# EAGLE design IFM_DuberFilter_ThroughHole_PCB_REV1a (EAGLE 9.6.2)
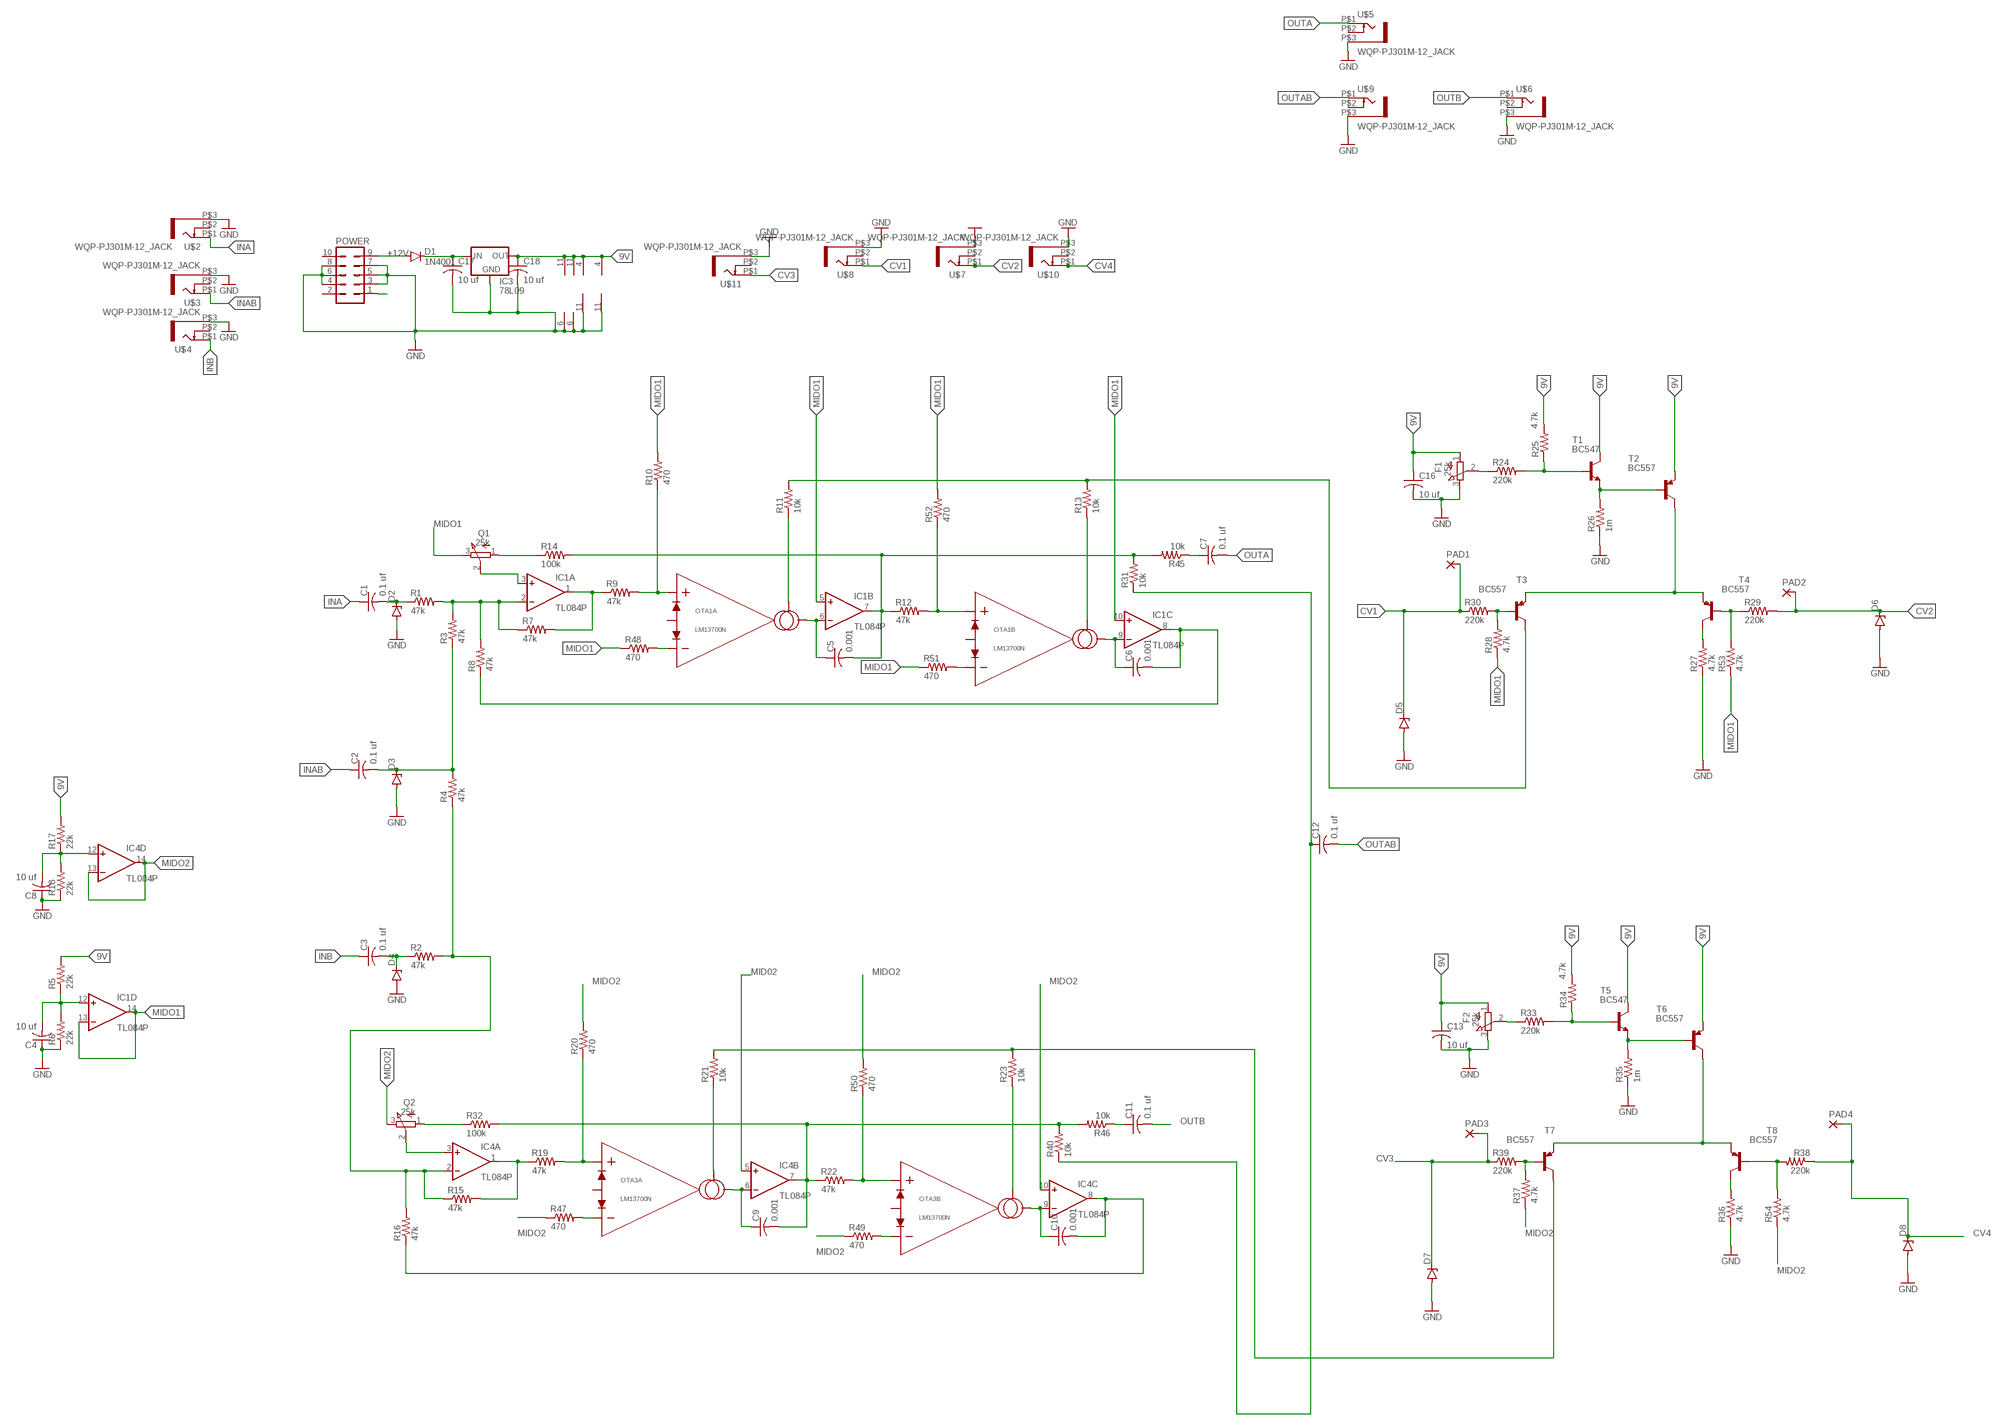
[diagram p0: schematic, sheet 1]

## Parts
C1  0.1 uf  C-US050-030X075  [C050-030X075]
C2  0.1 uf  C-US050-030X075  [C050-030X075]
C3  0.1 uf  C-US050-030X075  [C050-030X075]
C4  10 uf  C-US050-030X075  [C050-030X075]
C5  0.001  C-US050-030X075  [C050-030X075]
C6  0.001  C-US050-030X075  [C050-030X075]
C7  0.1 uf  C-US050-030X075  [C050-030X075]
C8  10 uf  C-US050-030X075  [C050-030X075]
C9  0.001  C-US050-030X075  [C050-030X075]
C10  0.001  C-US050-030X075  [C050-030X075]
C11  0.1 uf  C-US050-030X075  [C050-030X075]
C12  0.1 uf  C-US050-030X075  [C050-030X075]
C13  10 uf  C-US050-030X075  [C050-030X075]
C16  10 uf  C-US050-030X075  [C050-030X075]
C17  10 uf  C-US050-030X075  [C050-030X075]
C18  10 uf  C-US050-030X075  [C050-030X075]
D1  1N4001  1N4004  [DO41-10]
D2  ZENER-DIODEDO34-7  [DO34Z7]
D3  ZENER-DIODEDO34-7  [DO34Z7]
D4  ZENER-DIODEDO34-7  [DO34Z7]
D5  ZENER-DIODEDO34-7  [DO34Z7]
D6  ZENER-DIODEDO34-7  [DO34Z7]
D7  ZENER-DIODEDO34-7  [DO34Z7]
D8  ZENER-DIODEDO34-7  [DO34Z7]
F1  25k  EVUF3L  [EVUFXL]
F2  25k  EVUF3L  [EVUFXL]
IC1  TL084P  [DIL14]
IC3  78L09  78LXX  [78LXX]
IC4  TL084P  [DIL14]
OTA1  LM13700N  [DIP16]
OTA3  LM13700N  [DIP16]
PAD1  SMD2  [SMD1,27-2,54]
PAD2  SMD2  [SMD1,27-2,54]
PAD3  SMD2  [SMD1,27-2,54]
PAD4  SMD2  [SMD1,27-2,54]
POWER  10_PIN_HEADER  [MA05-2]
Q1  25k  EVUF3L  [EVUFXL]
Q2  25k  EVUF3L  [EVUFXL]
R1  47k  R-US_0204/7  [0204/7]
R2  47k  R-US_0204/7  [0204/7]
R3  47k  R-US_0204/7  [0204/7]
R4  47k  R-US_0204/7  [0204/7]
R5  22k  R-US_0204/7  [0204/7]
R6  22k  R-US_0204/7  [0204/7]
R7  47k  R-US_0204/7  [0204/7]
R8  47k  R-US_0204/7  [0204/7]
R9  47k  R-US_0204/7  [0204/7]
R10  470  R-US_0204/7  [0204/7]
R11  10k  R-US_0204/7  [0204/7]
R12  47k  R-US_0204/7  [0204/7]
R13  10k  R-US_0204/7  [0204/7]
R14  100k  R-US_0204/7  [0204/7]
R15  47k  R-US_0204/7  [0204/7]
R16  47k  R-US_0204/7  [0204/7]
R17  22k  R-US_0204/7  [0204/7]
R18  22k  R-US_0204/7  [0204/7]
R19  47k  R-US_0204/7  [0204/7]
R20  470  R-US_0204/7  [0204/7]
R21  10k  R-US_0204/7  [0204/7]
R22  47k  R-US_0204/7  [0204/7]
R23  10k  R-US_0204/7  [0204/7]
R24  220k  R-US_0204/7  [0204/7]
R25  4.7k  R-US_0204/7  [0204/7]
R26  1m  R-US_0204/7  [0204/7]
R27  4.7k  R-US_0204/7  [0204/7]
R28  4.7k  R-US_0204/7  [0204/7]
R29  220k  R-US_0204/7  [0204/7]
R30  220k  R-US_0204/7  [0204/7]
R31  10k  R-US_0204/7  [0204/7]
R32  100k  R-US_0204/7  [0204/7]
R33  220k  R-US_0204/7  [0204/7]
R34  4.7k  R-US_0204/7  [0204/7]
R35  1m  R-US_0204/7  [0204/7]
R36  4.7k  R-US_0204/7  [0204/7]
R37  4.7k  R-US_0204/7  [0204/7]
R38  220k  R-US_0204/7  [0204/7]
R39  220k  R-US_0204/7  [0204/7]
R40  10k  R-US_0204/7  [0204/7]
R45  10k  R-US_0204/7  [0204/7]
R46  10k  R-US_0204/7  [0204/7]
R47  470  R-US_0204/7  [0204/7]
R48  470  R-US_0204/7  [0204/7]
R49  470  R-US_0204/7  [0204/7]
R50  470  R-US_0204/7  [0204/7]
R51  470  R-US_0204/7  [0204/7]
R52  470  R-US_0204/7  [0204/7]
R53  4.7k  R-US_0204/7  [0204/7]
R54  4.7k  R-US_0204/7  [0204/7]
T1  BC547  [TO92]
T2  BC557  BC557A-PNP-TO92-EBC  [TO92-EBC]
T3  BC557  BC557A-PNP-TO92-EBC  [TO92-EBC]
T4  BC557  BC557A-PNP-TO92-EBC  [TO92-EBC]
T5  BC547  [TO92]
T6  BC557  BC557A-PNP-TO92-EBC  [TO92-EBC]
T7  BC557  BC557A-PNP-TO92-EBC  [TO92-EBC]
T8  BC557  BC557A-PNP-TO92-EBC  [TO92-EBC]
U$2  WQP-PJ301M-12_JACK  [WQP-PJ301M-12_JACK]
U$3  WQP-PJ301M-12_JACK  [WQP-PJ301M-12_JACK]
U$4  WQP-PJ301M-12_JACK  [WQP-PJ301M-12_JACK]
U$5  WQP-PJ301M-12_JACK  [WQP-PJ301M-12_JACK]
U$6  WQP-PJ301M-12_JACK  [WQP-PJ301M-12_JACK]
U$7  WQP-PJ301M-12_JACK  [WQP-PJ301M-12_JACK]
U$8  WQP-PJ301M-12_JACK  [WQP-PJ301M-12_JACK]
U$9  WQP-PJ301M-12_JACK  [WQP-PJ301M-12_JACK]
U$10  WQP-PJ301M-12_JACK  [WQP-PJ301M-12_JACK]
U$11  WQP-PJ301M-12_JACK  [WQP-PJ301M-12_JACK]

## Nets
9V: C13.1 C16.1 C18.1 F1.1(A) F2.1(A) IC1.4(P:V+) IC3.OUT IC4.4(P:V+) OTA1.11(PWR:VCC) OTA3.11(PWR:VCC) R5.2 R17.2 R25.2 R34.2 T1.3(C) T2.E T5.3(C) T6.E
+12V [power]: C17.1 D1.C IC3.IN
-12V [power]: POWER.1
CV1: D5.C PAD1.1(P) R30.1 U$8.P$1
CV2: D6.C PAD2.1(P) R29.2 U$7.P$1
CV3: D7.C PAD3.1(P) R39.1 U$11.P$1
CV4: D8.C PAD4.1(P) R38.1 U$10.P$1
GND: C4.1 C8.1 C13.2 C16.2 C17.2 C18.2 D2.A D3.A D4.A D5.A D6.A D7.A D8.A F1.3(E) F2.3(E) IC1.11(P:V-) IC3.GND IC4.11(P:V-) OTA1.6(PWR:VEE) OTA3.6(PWR:VEE) POWER.3 POWER.4 POWER.5 POWER.6 POWER.7 POWER.8 R6.1 R18.1 R26.1 R27.1 R35.1 R36.1 U$2.P$3 U$3.P$3 U$4.P$3 U$5.P$3 U$6.P$3 U$7.P$3 U$8.P$3 U$9.P$3 U$10.P$3 U$11.P$3
INA: C1.1 U$2.P$1
INAB: C2.1 U$3.P$1
INB: C3.1 U$4.P$1
MID02: IC4.5(B:+IN)
MIDO1: IC1.5(B:+IN) IC1.10(C:+IN) IC1.13(D:-IN) IC1.14(D:OUT) Q1.3(E) R10.2 R28.1 R48.1 R51.1 R52.2 R53.1
MIDO2: IC4.10(C:+IN) IC4.13(D:-IN) IC4.14(D:OUT) Q2.3(E) R20.2 R37.1 R47.1 R49.1 R50.2 R54.1
N$1: C3.2 D4.C R2.1
N$2: C1.2 D2.C R1.1
N$3: C2.2 D3.C R3.1 R4.2
N$4: IC4.2(A:-IN) R2.2 R4.1 R15.1 R16.2
N$5: IC1.2(A:-IN) R1.2 R3.2 R7.1 R8.2
N$6: OTA1.16(B:IABC) R13.1
N$7: C4.2 IC1.12(D:+IN) R5.1 R6.2
N$8: Q1.1(A) R14.1
N$9: OTA1.13(B:IN-) R51.2
N$10: IC4.1(A:OUT) R15.2 R19.1
N$11: IC1.1(A:OUT) R7.2 R9.1
N$12: OTA1.3(A:IN+) R9.2 R10.1
N$13: C5.1 IC1.6(B:-IN) OTA1.5(A:IOUT)
N$14: OTA1.1(A:IABC) R11.1
N$15: C5.2 IC1.7(B:OUT) R12.1 R14.2 R31.2 R45.2
N$16: R29.1 R53.2 T4.B
N$17: R11.2 R13.2 T3.C
N$18: C6.1 IC1.9(C:-IN) OTA1.12(B:IOUT)
N$19: C6.2 IC1.8(C:OUT) R8.1
N$20: IC1.3(A:+IN) Q1.2(S)
N$21: F1.2(S) R24.1
N$22: OTA1.14(B:IN+) R12.2 R52.1
N$23: OTA3.3(A:IN+) R19.2 R20.1
N$24: C8.2 IC4.12(D:+IN) R17.1 R18.2
N$25: C9.1 IC4.6(B:-IN) OTA3.5(A:IOUT)
N$26: OTA3.1(A:IABC) R21.1
N$27: C9.2 IC4.7(B:OUT) R22.1 R32.2 R40.2 R46.2
N$28: OTA3.16(B:IABC) R23.1
N$29: R21.2 R23.2 T7.C
N$30: Q2.1(A) R32.1
N$31: C10.1 IC4.9(C:-IN) OTA3.12(B:IOUT)
N$32: C10.2 IC4.8(C:OUT) R16.1
N$33: D1.A POWER.9
N$34: IC4.3(A:+IN) Q2.2(S)
N$35: OTA1.4(A:IN-) R48.2
N$36: R33.2 R34.1 T5.2(B)
N$38: R24.2 R25.1 T1.2(B)
N$40: R26.2 T1.1(E) T2.B
N$41: T2.C T3.E T4.E
N$42: R35.2 T5.1(E) T6.B
N$43: R27.2 T4.C
N$44: C12.1 R31.1 R40.1
N$45: R28.2 R30.2 T3.B
N$46: F2.2(S) R33.1
N$47: C11.1 R46.1
N$50: T6.C T7.E T8.E
N$51: R36.2 T8.C
N$52: R38.2 R54.2 T8.B
N$53: R37.2 R39.2 T7.B
N$55: OTA3.4(A:IN-) R47.2
N$56: OTA3.13(B:IN-) R49.2
N$57: OTA3.14(B:IN+) R22.2 R50.1
N$66: C7.1 R45.1
OUTA: C7.2 U$5.P$1
OUTAB: C12.2 U$9.P$1
OUTB: C11.2 U$6.P$1
Unconnected: OTA1.2(A:BIAS) OTA1.7(BUFA:IN) OTA1.8(BUFA:OUT) OTA1.9(BUFB:OUT) OTA1.10(BUFB:IN) OTA1.15(B:BIAS) OTA3.2(A:BIAS) OTA3.7(BUFA:IN) OTA3.8(BUFA:OUT) OTA3.9(BUFB:OUT) OTA3.10(BUFB:IN) OTA3.15(B:BIAS) POWER.2 POWER.10 U$2.P$2 U$3.P$2 U$4.P$2 U$5.P$2 U$6.P$2 U$7.P$2 U$8.P$2 U$9.P$2 U$10.P$2 U$11.P$2

## Library data of the parts
C1-C13 C16-C18 = rcl:C-US: CAPACITOR, American symbol; SPICEPREFIX: C
D1 = diode:1N4004: DIODE general purpose rectifier, 1 A
D2 D4-D8 = diode:ZENER-DIODE: Z-Diode
D3 = diode:ZENER-DIODE: Z-Diode; SPICEPREFIX: D
F1 F2 Q1 Q2 = pot:EVU: 9 mm Square Rotary Potentiometers Source: Panasonic
IC1 IC4 = linear:TL084: OP AMP
IC3 = v-reg:78LXX: VOLTAGE REGULATOR
OTA1 OTA3 = OTAs:LM13700: Dual OTA with linearizing diode and output buffers - 2MHz open-loop bandwidth - Linearizing diodes reduces distortion at higher differential input voltages - Darlington output buffers enables low-impedance output LM13700 or LM13600 The LM13700 differs from the LM13600 in that the 13700's output buffers are biased independently from the transconductance amplifier, allowing superior performance in audio applications. Originally released by National Semiconductor Manufactured by Texas Instruments.
PAD1-PAD4 = wirepad:SMD2: SMD PAD
POWER = TomW:10_PIN_HEADER: PIN HEADER; OC_FARNELL: unknown; OC_NEWARK: unknown
R1-R40 R45-R54 = rcl:R-US_: RESISTOR, American symbol; SPICEPREFIX: R
T1 T5 = transistor:BC547: NPN TRANSISTOR
T2-T4 T6-T8 = transistor:*-PNP-: PNP Transistror
U$2-U$11 = thonkiconn:WQP-PJ301M-12_JACK

## Net classes
1 power: width 0.61 mm

## Board
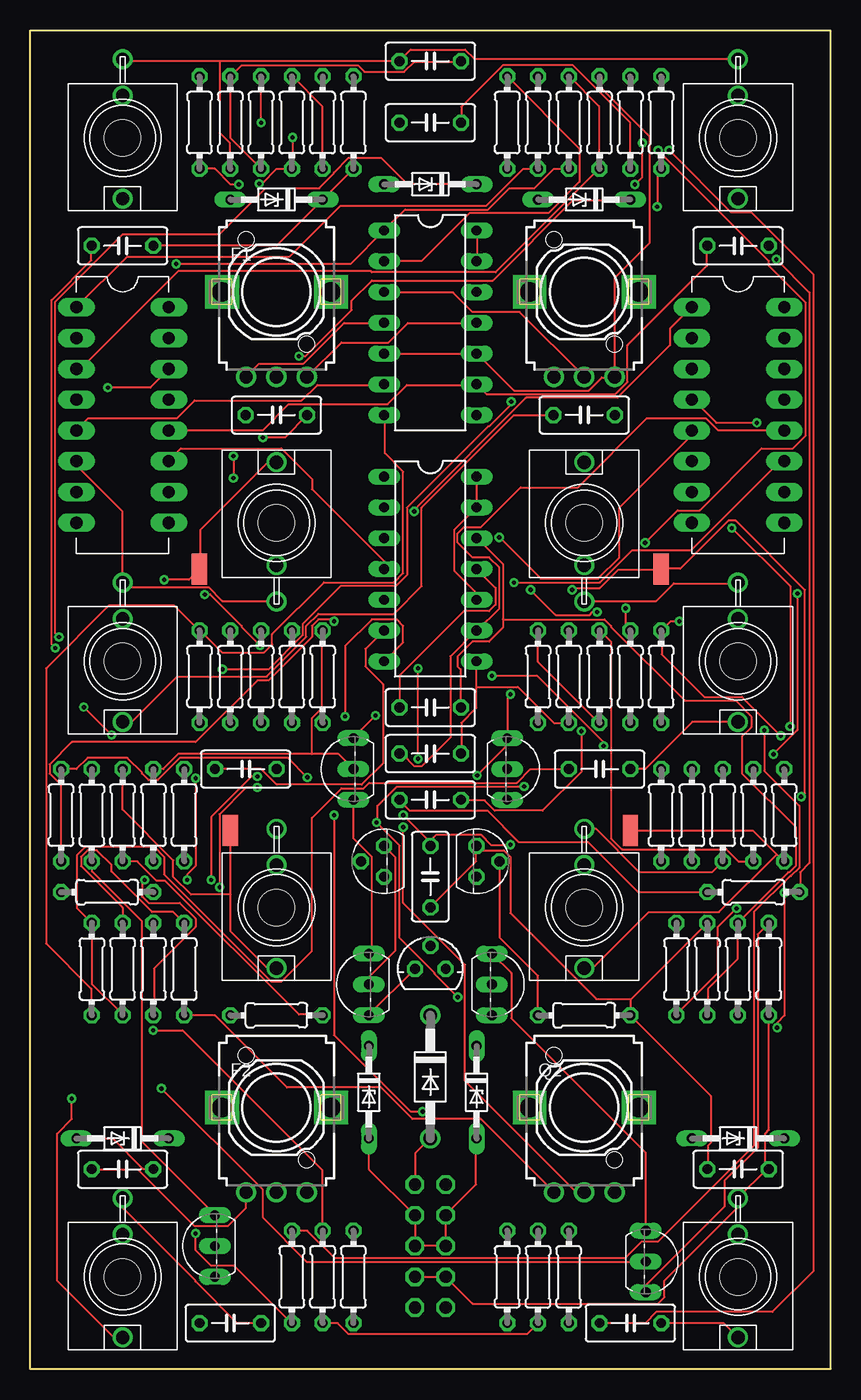
[diagram p1: board, top side]
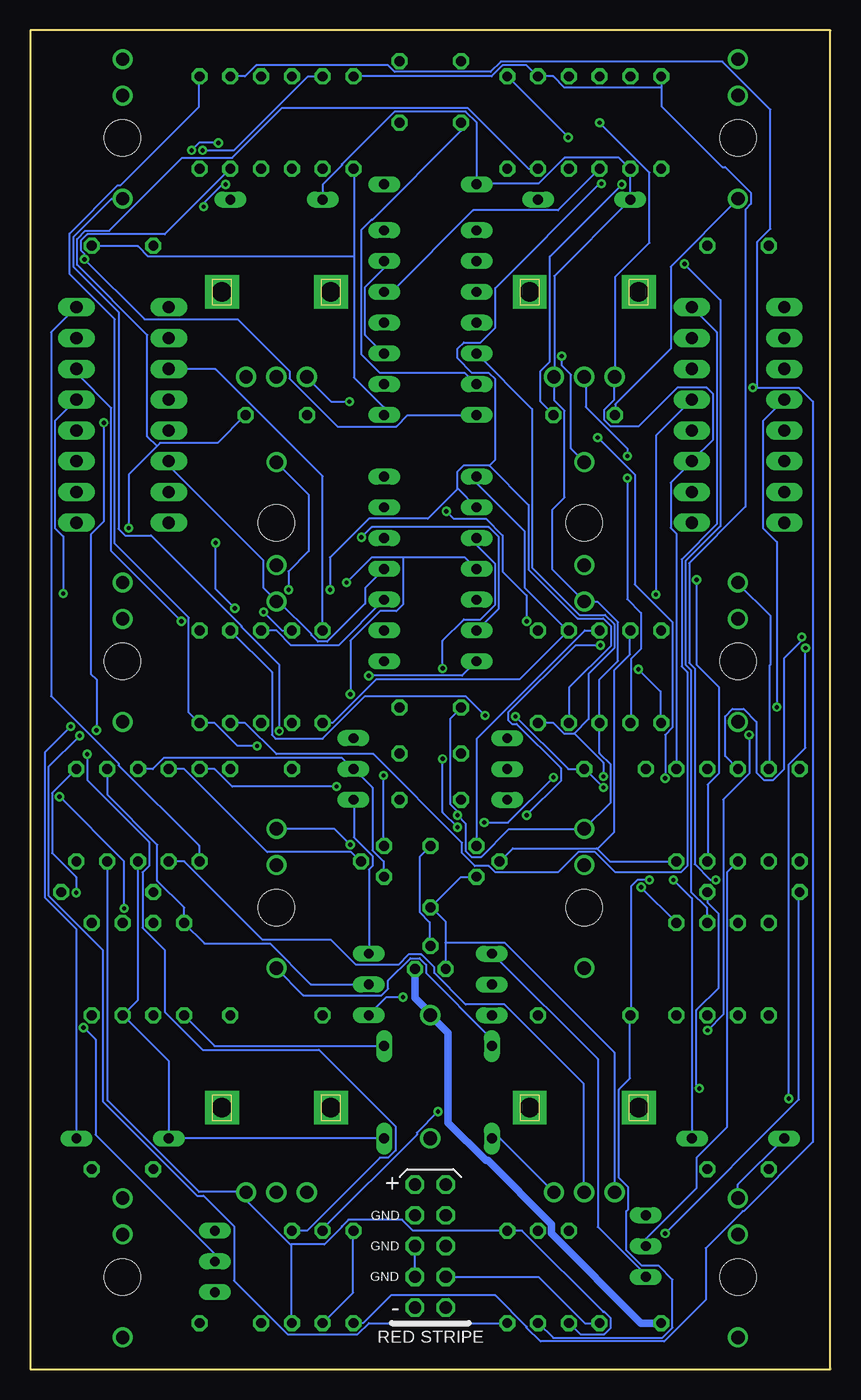
[diagram p2: board, bottom side, seen from below]

Size 66.04 x 110.49 mm. Coordinates in mm from the lower left corner, seen from the top.
Outline: 0,110.49 66.04,110.49 66.04,0 0,0 0,110.49
Copper layers (1*16): Top 0.035mm / dielectric 1.5mm / Bottom 0.035mm
Design rules "default": minimum track width 6mil, minimum drill 0.35mm, track to track 6mil, track to pad 6mil, pad to pad 6mil, via to via 6mil, smd to smd 6mil, copper to edge 40mil, drill to drill 6mil, minimum pad ring 10mil, minimum via ring 8mil, stop-mask expansion 4mil, vias tented up to drill 0mil, thermal gap 10mil
Holes 3 mm at 7.62,101.6 20.32,69.85 7.62,7.62 7.62,58.42 20.32,38.1 45.72,69.85 45.72,38.1 58.42,7.62 58.42,58.42 58.42,101.6

### Footprints (pad centres in the part's own frame; a part is rotated, then mirrored left to right if it is on the bottom)
C050-030X075 = drill 0.813 octagon: 1 -2.54,0; 2 2.54,0
DO41-10 = drill 1.118: A 5.08,0; C -5.08,0
DO34Z7 = drill 0.813 long: A 3.81,0; C -3.81,0
EVUFXL = drill 1.1 pad 1.676: 1 -2.5,-7; 2 0,-7; 3 2.5,-7 | drill 1.6 pad 2.8 square: M1 4.5,0; M2 -4.5,0
DIL14 = drill 0.813 long: 1 -7.62,-3.81; 2 -5.08,-3.81; 3 -2.54,-3.81; 4 0,-3.81; 5 2.54,-3.81; 6 5.08,-3.81; 7 7.62,-3.81; 8 7.62,3.81; 9 5.08,3.81; 10 2.54,3.81; 11 0,3.81; 12 -2.54,3.81; 13 -5.08,3.81; 14 -7.62,3.81
78LXX = drill 0.813 octagon: GND 0,1.905; IN 1.27,0; OUT -1.27,0
DIP16 = drill 1 long: 1 -3.81,0; 2 -3.81,-2.54; 3 -3.81,-5.08; 4 -3.81,-7.62; 5 -3.81,-10.16; 6 -3.81,-12.7; 7 -3.81,-15.24; 8 -3.81,-17.78; 9 3.81,-17.78; 10 3.81,-15.24; 11 3.81,-12.7; 12 3.81,-10.16; 13 3.81,-7.62; 14 3.81,-5.08; 15 3.81,-2.54; 16 3.81,0
SMD1,27-2,54 = smd 1.27 x 2.54: 1 0,0
MA05-2 = drill 1.016 octagon: 1 -5.08,-1.27; 2 -5.08,1.27; 3 -2.54,-1.27; 4 -2.54,1.27; 5 0,-1.27; 6 0,1.27; 7 2.54,-1.27; 8 2.54,1.27; 9 5.08,-1.27; 10 5.08,1.27
0204/7 = drill 0.813 octagon: 1 -3.81,0; 2 3.81,0
TO92 = drill 0.813 octagon: 1 1.27,0; 2 0,1.905; 3 -1.27,0
TO92-EBC = drill 0.813 long: B 0,-1.27; C 2.54,-1.27; E -2.54,-1.27
WQP-PJ301M-12_JACK = drill 1.1: P$1 0,5; P$2 0,-3.5; P$3 0,-6.5

### Placement (x,y rotation side)
C1  20.32,78.74 0 top
C2  45.72,78.74 0 top
C3  7.62,92.71 0 top
C4  33.02,107.95 0 top
C5  33.02,102.87 0 top
C6  58.42,92.71 0 top
C7  33.02,46.99 0 top
C8  33.02,54.61 0 top
C9  17.78,49.53 0 top
C10  33.02,50.8 0 top
C11  49.53,3.81 0 top
C12  46.99,49.53 0 top
C13  58.42,16.51 0 top
C16  7.62,16.51 0 top
C17  16.51,3.81 0 top
C18  33.02,40.64 90 top
D1  33.02,24.13 270 top
D2  7.62,19.05 180 top
D3  58.42,19.05 180 top
D4  20.32,96.52 180 top
D5  45.72,96.52 180 top
D6  33.02,97.79 180 top
D7  36.83,22.86 270 top
D8  27.94,22.86 270 top
F1  20.32,88.9 0 top
F2  20.32,21.59 0 top
IC1  33.02,86.36 270 top
IC3  33.02,33.02 0 top
IC4  33.02,66.04 270 top
OTA1  7.62,87.63 0 top
OTA3  58.42,87.63 0 top
PAD1  13.97,66.04 0 top
PAD2  16.51,44.45 0 top
PAD3  52.07,66.04 0 top
PAD4  49.53,44.45 0 top
POWER  33.02,10.16 90 bottom
Q1  45.72,88.9 0 top
Q2  45.72,21.59 0 top
R1  13.97,102.87 90 top
R2  26.67,102.87 90 top
R3  24.13,102.87 90 top
R4  21.59,102.87 90 top
R5  19.05,102.87 90 top
R6  16.51,102.87 90 top
R7  10.16,33.02 90 top
R8  39.37,102.87 90 top
R9  44.45,102.87 90 top
R10  46.99,102.87 90 top
R11  41.91,102.87 90 top
R12  49.53,102.87 90 top
R13  49.53,57.15 90 top
R14  13.97,57.15 90 top
R15  21.59,57.15 90 top
R16  44.45,57.15 90 top
R17  55.88,33.02 90 top
R18  58.42,33.02 90 top
R19  41.91,57.15 90 top
R20  46.99,57.15 90 top
R21  2.54,45.72 90 top
R22  52.07,57.15 90 top
R23  52.07,45.72 90 top
R24  16.51,57.15 90 top
R25  12.7,45.72 90 top
R26  19.05,57.15 90 top
R27  5.08,45.72 270 top
R28  24.13,57.15 90 top
R29  7.62,45.72 90 top
R30  10.16,45.72 90 top
R31  5.08,33.02 270 top
R32  12.7,33.02 90 top
R33  54.61,45.72 90 top
R34  45.72,29.21 0 top
R35  57.15,45.72 90 top
R36  60.96,33.02 90 top
R37  59.69,45.72 90 top
R38  62.23,45.72 90 top
R39  53.34,33.02 90 top
R40  7.62,33.02 90 top
R45  59.69,39.37 0 top
R46  52.07,102.87 90 top
R47  21.59,7.62 90 top
R48  24.13,7.62 90 top
R49  44.45,7.62 90 top
R50  26.67,7.62 90 top
R51  41.91,7.62 90 top
R52  39.37,7.62 90 top
R53  20.32,29.21 0 top
R54  6.35,39.37 0 top
T1  29.21,41.91 90 top
T2  26.67,31.75 90 top
T3  25.4,49.53 90 top
T4  13.97,10.16 90 top
T5  36.83,41.91 270 top
T6  40.64,49.53 270 top
T7  39.37,31.75 270 top
T8  52.07,8.89 270 top
U$2  7.62,101.6 180 top
U$3  7.62,58.42 180 top
U$4  7.62,7.62 180 top
U$5  58.42,101.6 180 top
U$6  58.42,7.62 180 top
U$7  20.32,38.1 180 top
U$8  20.32,69.85 0 top
U$9  58.42,58.42 180 top
U$10  45.72,38.1 180 top
U$11  45.72,69.85 0 top

### Tracks (layer width: path | path; a pad name or v marks a point on that pad's centre or on a via)
9V  (via drill 0.35)
  Top 0.152: R17.2 49.57,30.52 | 49.57,30.52 49.53,30.48 R34.2 49.53,29.18 56.16,22.55 56.16,18.67 55.93,18.44 55.93,16.54 C13.1 | C16.1 5.11,16.46 8.91,16.46 13.56,11.81 16.31,11.81 17.75,13.26 17.75,14.55 F2.1 | T2.E 27.96,29.26 31.7,32.99 IC3.OUT | 36.8,42.82 36.8,41.91 32.99,38.1 C18.1 | 36.8,42.82 36.8,43.13 T5.3 36.8,42.82 | v36.88,49 39.32,51.44 39.32,52.05 T6.E 39.4,52.12 39.4,55.47 v39.62,55.7 | 36.8,42.82 39.09,42.82 39.62,42.29 39.62,37.64 46.71,30.56 49.53,30.56 49.57,30.52 | IC1.4 29.18,86.33 25.91,86.33 22.55,82.98 18.9,82.98 17.83,81.92 F1.1 | v19.05,102.87 R5.2 | IC4.4 29.18,66.06 29.18,66.67 23.24,72.62 23.24,73.46 20.73,75.97 12.42,75.97 11.43,74.98 OTA1.11 | v39.93,64.92 47.02,64.92 49.68,67.59 54.56,67.59 61.87,74.91 62.18,74.91 OTA3.11
  Bottom 0.152: T1.3 29.26,40.62 30.48,40.62 32.99,38.1 C18.1 32.92,38.1 31.77,36.96 31.77,35.2 | v36.88,49 36.88,43.2 T5.3 | 31.77,35.2 31.77,33.07 IC3.OUT | 31.77,35.2 26.9,35.2 17.83,26.14 17.83,14.63 F2.1 | v19.05,102.87 14.94,98.75 14.94,92.96 17.75,90.14 17.75,81.92 F1.1 17.83,81.84 17.83,80.01 18.67,79.17 18.67,78.33 18.14,77.8 15.85,77.8 12.65,81 10.21,81 9.68,80.47 9.68,76.73 11.43,74.98 OTA1.11 11.43,74.91 13.18,73.15 13.18,69.42 12.72,68.96 12.72,49.53 R25.2 | v39.93,64.92 37.87,66.98 35.28,66.98 | 35.28,66.98 30.18,66.98 29.26,66.06 IC4.4 | v39.62,55.7 39.62,60.12 37.19,62.56 35.81,62.56 35.28,63.09 35.28,66.98
+12V
  Bottom 0.61: C17.1 15.62,3.81 23.01,11.2 23.01,11.96 28.27,17.22 28.42,17.22 31.55,20.34 31.55,27.74 D1.C 33.15,29.49 34.29,30.63 IC3.IN
CV1  (via drill 0.35)
  Top 0.152: U$8.P$1 20.27,74.83 19.58,74.83 14.02,69.27 14.02,66.06 PAD1.1 13.95,65.99 13.11,65.15 v11.05,65.15 | v22.17,83.59 22.71,83.59 26.52,87.4 26.52,88.16 28.19,89.84 38.18,89.84 44.81,96.47 49.53,96.47 D5.C
  Bottom 0.152: v11.05,65.15 11.05,58.14 9.22,56.31 9.22,49.15 10.13,48.23 10.13,41.91 R30.1 | v22.17,83.59 22.17,82.83 21.41,82.07 21.41,75.97 20.34,74.91 U$8.P$1
CV2  (via drill 0.35)
  Top 0.152: 16.54,39.17 16.54,36.12 19.51,33.15 20.27,33.15 U$7.P$1 | 16.54,39.17 16.54,44.42 PAD2.1 | R29.2 7.62,46.18 11.81,41.99 11.81,40.62 13.26,39.17 16.54,39.17 | v2.36,60.43 2.06,60.73 2.06,88.09 7.62,93.65 15.62,93.65 19.43,97.46 23.85,97.46 25.07,98.68 25.07,98.75 26.29,99.97 28.96,99.97 31.09,97.84 36.8,97.84 D6.C
  Bottom 0.152: v2.36,60.43 2.36,60.12 3.81,58.67 3.81,49.53 4.72,48.62 5.49,48.62 6.1,49.23 6.1,53.42 7.16,54.48 8.08,54.48 8.69,53.87 8.69,50.6 R29.2
CV3  (via drill 0.35)
  Top 0.152: v44.73,64.31 44.88,64.47 47.02,64.47 48.54,65.99 52.05,65.99 PAD3.1 52.12,66.06 53.65,66.06 57.61,70.03 58.22,70.03 63.93,64.31 63.93,47.55 v63.63,47.24 | v58.29,38.02 56.77,36.5 56.77,32.69 53.34,29.26 R39.1
  Bottom 0.152: v44.73,64.31 44.73,65.84 43.05,67.51 43.05,72.16 45.72,74.83 U$11.P$1 | D7.C 50.83,26.67 53.34,29.18 R39.1 | v63.63,47.24 58.29,41.91 v58.29,38.02
CV4
  Top 0.152: 61.61,42.48 62.18,41.91 R38.1 | 61.61,42.48 59.66,44.42 49.53,44.42 PAD4.1 | 61.61,42.48 56.84,37.72 51.05,37.72 46.48,33.15 45.72,33.15 U$10.P$1
  Bottom 0.152: D8.C 27.96,26.67 27.96,27.28 33.38,32.69 33.38,33.38 33.91,33.91 34.67,33.91 36.5,32.08 36.5,31.39 37.03,30.86 43.51,30.86 45.72,33.07 U$10.P$1
GND  (via drill 0.35)
  Top 0.152: R35.1 56.24,41 50.29,41 46.71,44.58 45.72,44.58 U$10.P$3 | 34.29,10.21 31.85,10.21 POWER.5 31.77,10.21 31.77,12.65 POWER.7 31.7,12.72 27.96,16.46 27.96,19.05 D8.A | D7.A 36.8,19.05 36.8,15.24 34.29,12.72 POWER.8 34.29,10.21 | 34.29,10.21 POWER.6 | R36.1 60.96,19.74 60.66,19.43 60.66,16.46 C13.2 60.96,16.46 60.73,16.46 58.45,14.17 U$6.P$3 58.37,14.1 58.37,13.34 52.35,7.32 52.35,5.94 51.82,5.41 36.5,5.41 POWER.4 POWER.3 | D2.A 6.78,19.05 9.3,16.54 10.13,16.54 C16.2 | U$4.P$3 7.62,13.34 13.64,7.32 13.64,7.24 17.07,3.81 C17.2 | IC1.11 36.8,86.33 31.17,86.33 29.57,84.73 25.68,84.73 22.86,81.92 F1.3 | 15.62,107.97 7.7,107.97 7.62,108.05 U$2.P$3 | 15.62,107.97 30.48,107.97 | 30.48,107.97 31.39,108.89 35.89,108.89 36.65,108.13 58.37,108.13 U$5.P$3 | 30.48,107.97 C4.1 | 15.62,107.97 15.62,102.03 16.46,101.19 16.46,99.06 R6.1 | OTA1.6 3.81,74.6 7.62,70.79 U$3.P$3 7.62,64.85 7.92,64.54 14.71,64.54 15.85,63.4 20.27,63.4 U$8.P$3 | U$9.P$3 58.37,64.85 53.11,64.85 51.66,63.4 45.72,63.4 U$11.P$3 | C8.1 30.48,57.23 35.81,62.56 37.87,62.56 38.41,63.09 38.41,64.47 IC4.11 | v30.79,45.72 32.99,43.51 32.99,43.2 C18.2 32.99,43.59 33.53,44.12 37.19,44.12 38.02,43.28 v39.62,43.28
  Bottom 0.152: R35.1 57.15,30.48 R18.1 58.37,29.18 54.63,25.45 54.63,19.05 D3.A D7.A | D8.A 27.28,19.05 22.86,14.63 F2.3 | D2.A 7.62,15.24 U$4.P$3 | C17.2 20.27,3.81 24.08,7.62 POWER.3 | POWER.4 POWER.6 | 16.54,99.06 16.54,96.55 D4.A 16.54,96.47 22.78,90.22 22.78,81.92 F1.3 22.78,81.84 22.78,79.93 21.95,79.1 21.95,71.93 22.94,70.94 22.94,65.99 20.34,63.4 U$8.P$3 20.27,63.32 19.2,63.32 17.53,61.65 17.53,58.45 19.05,56.92 R26.1 19.05,50.83 18.14,49.91 18.14,46.79 20.27,44.65 U$7.P$3 20.34,44.58 26.52,44.58 28.8,42.29 29.64,42.29 30.1,42.75 30.1,45.03 v30.79,45.72 30.79,46.02 31.39,46.63 31.39,53.65 30.48,54.56 C8.1 | 16.54,99.06 17.45,99.97 21.95,99.97 24.08,97.84 29.18,97.84 D6.A 29.18,97.92 29.18,102.87 30.1,103.78 35.97,103.78 40.31,99.44 40.31,99.36 41.91,97.77 D5.A | 16.54,99.06 R6.1 | R27.1 5.03,49.53 5.03,58.06 4.95,58.14 4.95,62.18 7.62,64.85 U$3.P$3 | OTA3.6 54.56,74.91 54.56,74.52 46.79,66.75 46.79,64.47 45.72,63.4 U$11.P$3 45.72,63.32 45.49,63.32 42.82,60.66 42.82,60.58 42.29,60.05 41.53,60.05 38.41,63.17 38.41,64.47 IC4.11 | C18.2 33.91,42.29 33.91,37.72 33.07,36.88 33.07,34.98 IC3.GND | v39.62,43.28 40.92,44.58 45.72,44.58 U$10.P$3
INA
  Bottom 0.152: C1.1 17.75,78.79 17.75,79.63 13.18,84.2 13.18,90.98 7.62,96.55 U$2.P$1
INAB
  Top 0.152: C2.1 43.13,78.72 39.93,78.72 32.31,71.09 32.31,64.62 30.02,62.33 23.77,62.33 22.78,61.34 22.78,60.43 19.51,57.15 12.12,57.15 8.46,53.49 7.62,53.49 U$3.P$1
INB  (via drill 0.35)
  Top 0.152: v2.06,59.51 1.75,59.82 1.75,88.24 5.03,91.52 5.03,92.66 C3.1 | v3.43,22.33 3.43,20.65 2.21,19.43 2.21,7.32 6.86,2.67 7.62,2.67 U$4.P$1
  Bottom 0.152: v2.06,59.51 2.06,51.28 3.43,49.91 v3.43,22.33
MIDO1  (via drill 0.35)
  Top 0.152: R48.1 25.38,3.81 26.29,2.9 41,2.9 R51.1 | R10.2 47.02,106.68 47.02,105.84 51.13,101.73 51.13,92.96 48.23,90.07 48.23,81.92 Q1.3 48.16,81.84 47.17,81.84 46.1,80.77 39.93,80.77 36.88,83.82 IC1.10 IC1.5 | IC1.13 36.88,91.44 36.88,93.95 IC1.14 | v14.94,40.39 14.94,45.57 18.29,48.92 v18.75,48.92
  Bottom 0.152: R48.1 24.08,3.81 22.86,2.59 13.87,2.59 13.03,3.43 13.03,7.39 14.17,8.53 15.54,8.53 16.84,9.83 16.84,13.03 16.69,13.18 16.69,15.01 17.45,15.77 17.45,23.09 16.54,24 16.54,29.18 R53.1 16.46,29.26 16.46,39.85 15.93,40.39 v14.94,40.39 | R51.1 39.4,6.33 39.4,11.43 R52.2 | R28.1 22.86,53.34 21.95,52.43 21.18,52.43 21.14,52.46 | 21.14,52.46 19.96,53.65 19.96,57.38 17.83,59.51 17.83,61.49 18.59,62.26 20.73,62.26 24.61,66.14 24.61,79.25 29.18,83.82 IC1.5 | IC1.13 36.88,91.44 36.88,90.83 38.41,89.31 38.41,85.34 36.88,83.82 IC1.10 | v18.75,48.92 18.75,50.06 21.14,52.46
MIDO2  (via drill 0.35)
  Top 0.152: IC4.10 36.8,63.55 36.8,64.08 34.98,65.91 34.98,69.27 IC4.13 36.88,71.17 36.88,73.61 IC4.14 | R37.1 58.45,41.91 57.45,42.9 48.84,42.9 47.93,43.81 47.93,60.05 47.02,60.96 R20.2 | v13.64,11.2 13.64,9.83 14.94,8.53 16.84,8.53 21.57,3.81 R47.1
  Bottom 0.152: R20.2 45.72,60.96 44.5,59.74 40.62,59.74 36.88,63.48 IC4.10 | 44.54,10.25 48.16,13.87 48.16,14.55 Q2.3 48.23,14.63 52.12,14.63 59.66,22.17 59.66,41.91 R37.1 | 44.54,10.25 44.5,10.21 44.5,3.81 R49.1 | v13.64,11.2 2.59,22.25 2.59,39.32 R54.1 | R47.1 21.57,3.81 20.65,2.9 18.67,2.9 18.14,3.43 18.14,4.19 18.67,4.72 18.75,4.72 25.45,11.43 R50.2 34.44,11.43 35.36,12.34 39.78,12.34 40.31,11.81 40.31,11.73 41.76,10.29 44.5,10.29 44.54,10.25
N$1
  Top 0.152: C3.2 10.21,92.73 20.34,92.73 D4.C R2.1
N$2  (via drill 0.35)
  Top 0.152: v12.95,40.39 12.95,40.84 13.64,41.53 v13.64,48.77 | v19.2,76.89 21.03,76.89 22.86,78.72 C1.2 | R1.1 15.24,99.06 16.54,97.77 v17.22,97.77
  Bottom 0.152: D2.C 11.43,38.86 v12.95,40.39 | v13.64,48.77 13.64,52.35 13.03,52.96 13.03,61.65 16.15,64.77 16.15,73.84 v19.2,76.89 | v17.22,97.77 23.16,91.82 23.16,83.13 23.93,82.37 23.93,79.86 22.86,78.79 C1.2
N$3  (via drill 0.35)
  Top 0.152: R3.1 24.08,99.06 24.08,104.24 21.64,106.68 R4.2 | v62.71,53.03 62.71,64.62 v57.91,69.42
  Bottom 0.152: v62.71,53.03 64.85,50.9 64.85,38.94 62.26,36.35 62.26,19.05 D3.C | v57.91,69.42 57.91,73.84 55.59,76.16 | 55.59,76.16 55.32,76.43 50.6,76.43 48.31,78.72 C2.2 | R3.1 24.92,99.06 29.95,104.09 45.26,104.09 49.38,99.97 53.49,99.97 59.51,93.95 61.49,93.95 62.18,93.27 62.18,91.14 56.39,85.34 56.39,76.96 55.59,76.16
N$4  (via drill 0.35)
  Top 0.152: v21.64,101.65 21.64,99.06 R4.1 20.34,99.06 19.13,97.84 v18.9,97.84 | v46.79,62.48 46.41,62.48 46.18,62.26 43.36,62.26 v41.3,64.31
  Bottom 0.152: R2.2 v21.64,101.65 | 28.16,74.56 28.19,74.6 30.25,74.6 30.79,74.07 30.79,72.69 30.75,72.66 | 28.16,74.56 24.92,71.32 24.92,65.99 20.88,61.95 18.75,61.95 18.14,61.34 18.14,59.66 21.57,56.24 21.57,53.34 R15.1 | IC4.2 30.75,72.66 | R16.2 45.26,60.96 v46.79,62.48 | v41.3,64.31 41.3,66.98 38.1,70.18 33.22,70.18 30.75,72.66 | v18.9,97.84 19.05,97.84 27.66,89.23 27.66,85.95 28.88,84.73 30.25,84.73 30.79,84.2 30.79,83.44 29.57,82.22 28.19,82.22 27.66,81.69 27.66,75.06 28.16,74.56
N$5  (via drill 0.35)
  Top 0.152: IC1.2 32.31,91.44 36.27,95.4 42.75,95.4 45.34,97.99 45.34,100.74 39.4,106.68 R8.2 | v9.45,40.39 9.22,40.16 9.22,39.01 9.75,38.48 12.34,38.48 13.64,37.19 13.64,36.5 10.21,33.07 10.21,29.26 R7.1
  Bottom 0.152: v9.45,40.39 9.91,40.39 11.2,41.68 11.2,57.84 11.66,58.29 11.66,66.52 7.01,71.17 7.01,95.71 6.55,96.16 6.55,97.08 8.69,99.21 8.91,99.21 13.95,104.24 13.95,105.77 | 13.95,105.77 13.95,106.68 R1.2 | 13.95,105.77 21.95,105.77 22.86,106.68 R3.2 24.16,106.68 25.07,107.59 27.05,107.59 27.96,106.68 R8.2
N$6
  Bottom 0.152: R13.1 48.31,53.34 45.72,50.75 37.72,50.75 30.4,43.43 30.4,42.6 29.34,41.53 28.19,41.53 27.66,41 22.48,41 20.8,42.67 19.43,42.67 17.75,41 12.34,41 11.81,41.53 11.81,57.53 12.27,57.99 12.27,66.83 9.37,69.72 9.37,85.57 OTA1.16
N$7
  Top 0.152: 16.54,106.68 16.54,101.58 R5.1 | 16.54,106.68 17.45,107.59 27.05,107.59 27.58,107.06 30.86,107.06 31.7,107.9 35.51,107.9 C4.2 | 16.54,106.68 R6.2
  Bottom 0.152: R5.1 22.48,95.63 29.49,95.63 36.2,88.92 36.8,88.92 IC1.12
N$8  (via drill 0.35)
  Top 0.152: v15.85,57.76 19.66,57.76 22.48,60.58 22.48,61.49 25.6,64.62 30.18,64.62 31.09,65.53 31.09,71.09 37.8,77.8 37.87,77.8 39.7,79.63 v39.7,79.86
  Bottom 0.152: v15.85,57.76 14.02,55.93 14.02,53.34 R14.1 | v39.7,79.86 41.22,79.86 43.2,81.84 Q1.1
N$9  (via drill 0.35)
  Top 0.152: v32.38,21.26 31.39,21.26 25.07,27.58 v25.07,45.72 | v18.97,59.74 17.45,61.27 17.45,61.34 14.86,63.93 v14.4,63.93
  Bottom 0.152: R51.2 41.91,11.58 34.14,19.36 34.14,19.51 v32.38,21.26 | v25.07,45.72 22.25,48.54 22.25,49.61 25.91,53.26 26.29,53.26 26.59,53.57 26.59,54.18 21.03,59.74 v18.97,59.74 | v14.4,63.93 14.4,77.04 OTA1.13
N$10
  Bottom 0.152: R19.1 41.07,53.34 37.49,56.92 25.68,56.92 21.64,60.96 R15.2 21.72,60.96 25.22,64.47 25.22,69.11 29.18,73.08 29.18,73.61 IC4.1
N$11  (via drill 0.35)
  Top 0.152: v12.04,91.21 26.44,91.21 IC1.1 30.94,95.71 37.8,95.71 39.55,97.46 41.6,97.46 43.2,99.06 R9.1
  Bottom 0.152: v12.04,91.21 9.07,88.24 9.07,69.57 11.96,66.67 11.96,58.14 11.51,57.68 11.51,39.4 10.21,38.1 10.21,36.88 R7.2
N$12
  Top 0.152: 46.94,99.06 46.94,104.24 44.5,106.68 R9.2 | 46.94,99.06 38.41,90.53 28.19,90.53 28.12,90.6 12.19,90.6 4.19,82.6 3.81,82.6 OTA1.3 | 46.94,99.06 R10.1
N$13
  Top 0.152: IC1.6 29.18,81.23 23.7,81.23 22.4,79.93 13.56,79.93 12.12,78.49 4.8,78.49 3.81,77.5 OTA1.5
  Bottom 0.152: C5.1 30.48,102.18 37.8,94.87 37.87,94.87 38.71,94.03 38.71,83.74 37.19,82.22 30.18,82.22 29.26,81.31 IC1.6
N$14
  Top 0.152: R11.1 40.69,99.06 37.64,96.01 25.6,96.01 21.41,91.82 8,91.82 OTA1.1
N$15  (via drill 0.35)
  Top 0.152: R31.2 5.03,29.26 5.03,31.39 1.29,35.13 1.29,57.84 6.48,63.02 11.89,63.02 13.95,60.96 R14.2 14.02,60.96 15.85,59.13 19.28,59.13 19.96,59.82 19.96,60.66 24.23,64.92 30.02,64.92 30.79,65.68 30.79,74.07 29.26,75.59 29.26,78.72 IC1.7 | v61.57,91.59 64.31,88.85 64.31,41.76 63.55,41 63.55,39.4 R45.2 | R12.1 49.53,102.87 44.81,107.59 39.01,107.59 35.59,104.17 35.59,102.87 C5.2
  Bottom 0.152: R12.1 54.94,93.65 61.34,93.65 61.87,93.12 61.87,92.35 61.57,92.05 v61.57,91.59 56.62,86.64 48.92,86.64 44.65,82.37 44.65,81.76 40.69,77.8 35.81,77.8 34.9,78.72 29.26,78.72 IC1.7
N$16
  Top 0.152: R29.1 8.84,41.91 10.44,40.31 11.12,40.31 22.17,29.26 24.08,29.26 R53.2
  Bottom 0.152: T4.B 15.24,10.74 11.05,14.94 11.05,17.45 8.53,19.96 8.53,41 R29.1
N$17  (via drill 0.35)
  Top 0.152: v28.5,53.95 26.67,52.12 T3.C | v51.82,100.58 60.96,91.44 60.96,91.06 64.01,88.01 64.01,77.04 62.94,75.97 60.35,75.97 55.24,70.87 53.42,70.87 v50.75,68.2 | v49.15,62.79 49.15,61.34 R13.2
  Bottom 0.152: v28.5,53.95 30.1,55.55 38.41,55.55 41.91,52.05 45.8,52.05 46.1,52.35 46.1,57.53 R13.2 | R11.2 43.13,106.68 49.23,100.58 v51.82,100.58 | v50.75,68.2 50.75,64.39 v49.15,62.79
N$18
  Top 0.152: OTA1.12 11.43,77.5 19.2,77.5 21.34,79.63 29.49,79.63 31.09,81.23 36.8,81.23 IC1.9 37.64,80.47 48.31,80.47 49.3,81.46 49.3,84.51 55.85,91.06 55.85,92.66 C6.1
N$19
  Bottom 0.152: 39.32,91.82 39.32,99.06 R8.1 | 39.32,91.82 39.32,81.84 36.88,79.4 36.88,78.79 IC1.8 | 39.32,91.82 56.31,91.82 57.15,92.66 60.96,92.66 C6.2
N$20
  Top 0.152: IC1.3 29.26,88.85 34.9,88.85 36.5,87.25 40.39,87.25 45.72,81.92 Q1.2
N$21  (via drill 0.35)
  Top 0.152: v16.76,75.36 v16.76,73.53
  Bottom 0.152: v16.76,73.53 16.76,63.55 15.62,62.41 15.62,59.44 16.46,58.6 16.46,53.34 R24.1 | v16.76,75.36 16.76,75.97 20.19,79.4 20.19,81.76 20.27,81.84 F1.2
N$22  (via drill 0.35)
  Top 0.152: v6.4,81 9.91,81 11.43,82.53 OTA1.14
  Bottom 0.152: R52.1 38.56,3.81 36.27,6.1 27.66,6.1 25.07,3.5 25.07,3.43 23.93,2.29 13.72,2.29 10.29,5.71 10.29,9.98 7.24,13.03 7.16,13.03 1.45,18.75 1.45,79.86 2.59,81 6.02,81 | v6.4,81 6.02,81 | R12.2 48.31,106.68 47.4,107.59 36.5,107.59 35.97,107.06 28.04,107.06 27.2,107.9 8.91,107.9 4.95,103.94 4.95,94.11 6.02,93.04 6.02,81
N$23
  Top 0.152: R19.2 41.91,58.37 46.94,53.34 R20.1
  Bottom 0.152: R19.2 41.91,73.69 50.75,82.53 54.56,82.53 OTA3.3
N$24
  Top 0.152: R17.1 55.93,29.26 55.93,31.39 58.37,33.83 58.37,36.8 R18.2 58.45,36.88 62.56,41 62.64,41 63.17,41.53 63.17,44.73 58.75,49.15 58.75,52.2 59.51,52.96 59.51,53.87 58.22,55.17 54.03,55.17 47.93,61.27 47.93,61.34 47.4,61.87 39.01,61.87 | 39.01,61.87 39.01,66.45 36.88,68.58 IC4.12 | 39.01,61.87 39.01,61.19 37.87,60.05 36.5,60.05 35.28,58.83 35.28,57.99 35.51,57.76 35.51,54.63 C8.2
N$25  (via drill 0.35)
  Top 0.152: C9.1 19.05,49.53 20.34,48.23 27.36,48.23 29.11,49.99 29.11,56.54 27.66,57.99 27.66,59.44 29.18,60.96 IC4.6 | v38.71,68.66 42.14,65.23 46.86,65.23 48.62,66.98 48.62,71.09 54.56,77.04 54.56,77.42 OTA3.5
  Bottom 0.152: v38.71,68.66 37.87,69.49 28.19,69.49 27.36,68.66 27.36,62.79 29.18,60.96 IC4.6
N$26  (via drill 0.35)
  Top 0.152: v25.07,61.72 24.92,61.87 23.77,61.87 23.24,61.34 23.24,60.43 19.66,56.84 18.75,56.84 13.64,51.74 3.43,51.74 1.6,49.91 1.6,49.15 2.52,48.23 2.52,41.91 R21.1 | v31.7,70.79 31.7,70.94 40.92,80.16 48.46,80.16 52.81,84.51 52.81,85.88 54.56,87.63 OTA3.1
  Bottom 0.152: v25.07,61.72 25.07,63.86 27.05,65.84 27.05,68.81 28.42,70.18 31.09,70.18 v31.7,70.79
N$27  (via drill 0.35)
  Top 0.152: R40.2 7.62,38.1 4.19,41.53 4.19,42.29 4.72,42.82 5.49,42.82 6.71,41.6 6.71,41.07 10.06,37.72 11.81,37.72 R32.2 | v25.98,53.87 25.98,59.66 28.19,61.87 30.25,61.87 30.79,61.34 30.79,59.97 29.26,58.45 IC4.7 | v47.32,51.44 47.32,51.74 41.83,57.23 v38.1,57.23 | v15.62,39.78 15.62,45.8 17.83,48.01 v18.75,48.01
  Bottom 0.152: v25.98,53.87 21.64,49.53 C9.2 20.27,49.53 v18.75,48.01 | v47.32,51.44 48.92,51.44 50.83,53.34 R22.1 52.12,53.34 52.96,54.18 52.96,62.03 59.05,68.12 59.05,86.64 62.79,90.37 62.79,93.73 58.83,97.69 58.6,97.69 52.12,104.17 52.12,106.68 R46.2 | v38.1,57.23 30.4,57.23 IC4.7 | v15.62,39.78 12.72,36.88 R32.2
N$28
  Bottom 0.152: R23.1 52.12,41.91 52.12,43.2 58.75,49.84 58.75,49.99 64.31,55.55 64.31,85.57 62.26,87.63 OTA3.16
N$29  (via drill 0.35)
  Top 0.152: R21.2 3.81,49.53 4.72,50.44 8,50.44 9.22,49.23 9.22,49.15 9.75,48.62 10.52,48.62 12.34,50.44 21.26,50.44 v22.86,48.84 | v35.28,30.71 33.38,32.61 33.38,32.69 30.48,35.59 30.48,43.2 v28.57,45.11 28.65,45.11 28.65,46.48 30.25,48.08 v40.77,48.08
  Bottom 0.152: v22.86,48.84 26.59,45.11 v28.57,45.11 | v35.28,30.71 36.65,30.71 38.1,29.26 T7.C | R23.2 50.83,49.53 49.38,48.08 v40.77,48.08
N$30
  Top 0.152: R32.1 12.72,29.18 15.24,29.18 21.18,23.24 28.96,23.24 31.55,20.65 37.19,20.65 43.2,14.63 Q2.1
N$31
  Top 0.152: C10.1 30.48,50.75 30.71,50.75 31.7,49.76 32.31,49.76 34.67,52.12 34.67,58.83 36.8,60.96 IC4.9 36.88,60.96 38.71,62.79 38.71,66.14 37.87,66.98 36.5,66.98 35.28,68.2 35.28,68.96 35.81,69.49 37.19,69.49 40.46,72.77 45.19,72.77 50.9,78.49 55.78,78.49 56.77,77.5 62.18,77.5 OTA3.12
N$32
  Top 0.152: 36.8,56.31 36.8,58.37 IC4.8 | 36.8,56.31 36.8,54.56 35.59,53.34 35.59,50.83 C10.2 | R16.1 43.2,53.34 40.23,56.31 36.8,56.31
N$33
  Top 0.152: POWER.9 31.77,15.24 31.77,17.83 32.99,19.05 D1.A
N$34  (via drill 0.35)
  Top 0.152: v32,50.37 v32,57.84 | v30.79,44.73 30.79,38.48 35.89,33.38 35.89,23.77 45.03,14.63 45.72,14.63 Q2.2
  Bottom 0.152: v32,57.84 32,60.12 30.25,61.87 28.88,61.87 27.66,63.09 27.66,66.45 29.18,67.97 29.18,68.58 IC4.3 | v32,50.37 32,45.95 v30.79,44.73
N$35  (via drill 0.35)
  Top 0.152: v10.13,27.96 12.57,27.96 24.08,16.46 24.08,11.43 R48.2 | v4.42,54.63 v6.71,52.35
  Bottom 0.152: v10.13,27.96 8.84,29.26 8.84,47.02 6.71,49.15 v6.71,52.35 | v4.42,54.63 4.42,68.28 5.56,69.42 5.56,78.26 OTA1.4
N$36
  Top 0.152: R34.1 41.91,32.46 38.79,35.59 38.79,41.91 T5.2
  Bottom 0.152: R33.2 53.34,49.53 46.48,42.67 39.55,42.67 38.79,41.91 T5.2
N$38
  Bottom 0.152: R25.1 18.21,41.91 19.24,42.94 | 19.24,42.94 19.28,42.98 26.21,42.98 27.28,41.91 T1.2 | 19.24,42.94 17.83,44.35 17.83,57.68 16.54,58.98 16.54,60.96 R24.2
N$40
  Top 0.152: T1.1 30.1,42.29 30.1,34.52 27.96,32.38 27.96,31.77 T2.B
  Bottom 0.152: R26.2 20.27,60.96 29.18,52.05 29.18,43.2 T1.1
N$41
  Top 0.152: T3.E 26.67,43.81 28.19,42.29 28.19,34.52 27.96,34.29 T2.C
  Bottom 0.152: T4.E 15.24,7.77 19.2,11.73 19.2,25.6 27.89,34.29 T2.C
N$42
  Bottom 0.152: T5.1 36.88,40.69 36.88,41.91 37.8,42.82 37.8,48.01 39.32,49.53 T6.B 39.4,49.53 40.31,50.44 55.02,50.44 55.93,49.53 R35.2
N$43
  Top 0.152: R27.2 5.11,41.91 5.11,41.07 9.22,36.96 9.22,18.75 15.24,12.72 T4.C
N$44
  Top 0.152: R40.1 7.62,29.26 5.11,31.77 5.11,36.8 R31.1 3.89,38.02 3.89,42.44 4.57,43.13 10.21,43.13 11.05,42.29 11.05,40.84 19.89,32 20.73,32 23.24,34.52 23.24,45.49 25.68,47.93 27.51,47.93 27.96,48.39 40.16,48.39 41.3,49.53 C12.1
N$45
  Top 0.152: R30.2 10.97,49.53 12.19,50.75 23.24,50.75 | 23.24,50.75 25.45,50.75 T3.B | 23.24,50.75 23.24,53.72 24.08,54.56 24.08,60.96 R28.2
N$46
  Bottom 0.152: R33.1 53.34,41.91 46.86,35.43 41.22,35.43 39.17,33.38 35.66,33.38 34.82,34.21 33.76,34.21 32.69,33.15 32.69,32.69 30.1,30.1 26.9,30.1 20.34,23.55 20.34,14.63 F2.2
N$47  (via drill 0.35)
  Top 0.152: C11.1 50.75,3.81 51.66,4.72 61.27,4.72 64.62,8.08 64.62,90.37 59.51,95.48 57.84,95.48 v52.73,100.58 | v50.52,101.19 50.52,98.37 v49.91,97.77 | v51.74,95.94 51.74,98.75 52.05,99.06 R46.1
  Bottom 0.152: v52.73,100.58 52.12,101.19 v50.52,101.19 | v49.91,97.77 50.22,97.77 51.74,96.24 v51.74,95.94
N$50
  Top 0.152: T7.E 39.7,32.69 39.7,28.96 50.75,17.91 50.75,11.43 T8.E
  Bottom 0.152: T7.E 38.1,41.22 37.8,41.53 37.8,42.37 39.32,43.89 39.32,46.94 T6.C
N$51
  Top 0.152: T8.C 50.83,6.4 50.83,6.93 57.3,13.41 57.3,15.54 60.05,18.29 60.05,35.89 60.96,36.8 R36.2
N$52  (via drill 0.35)
  Top 0.152: v61.65,28.19 61.65,28.57 62.26,29.18 v62.26,39.32 | v10.82,23.16 19.2,14.78 19.2,12.5 22.86,8.84 50.75,8.84 T8.B
  Bottom 0.152: v61.65,28.19 60.66,27.2 60.66,19.36 50.83,9.53 50.83,8.91 T8.B | v62.26,39.32 62.26,40.62 64.24,42.6 64.24,47.55 62.26,49.53 R38.2 | v10.82,23.16 11.05,23.39 11.05,29.64 9.22,31.47 9.22,37.57 10.13,38.48 10.13,39.32 R54.2
N$53
  Bottom 0.152: T7.B 38.1,31.77 42.9,31.77 46.25,35.13 51.66,35.13 53.34,36.8 R39.2 53.34,38.1 55.55,40.31 55.55,43.28 59.66,47.4 59.66,49.53 R37.2
N$55  (via drill 0.35)
  Top 0.152: R47.2 22.86,11.43 25.15,9.14 49.07,9.14 50.44,10.52 51.82,10.52 59.74,18.44 59.74,37.72 62.71,40.69 62.79,40.69 63.48,41.38 63.48,46.48 60.58,49.38 v60.58,52.73 | v59.97,78.11 56.62,78.11 54.71,80.01 OTA3.4
  Bottom 0.152: v60.58,52.73 60.58,56.92 61.04,57.38 61.04,68.89 59.97,69.95 v59.97,78.11
N$56  (via drill 0.35)
  Top 0.152: v61.34,50.75 63.32,52.73 v63.32,64.01
  Bottom 0.152: R49.2 43.2,11.43 37.19,17.45 36.5,17.45 35.89,18.06 35.89,20.04 42.22,26.36 51.82,26.36 54.94,29.49 54.94,34.59 56.77,36.42 56.77,41 56.24,41.53 56.24,43.51 61.34,48.62 v61.34,50.75 | v63.32,64.01 63.32,68.73 64.01,69.42 64.01,78.26 62.26,80.01 OTA3.13
N$57  (via drill 0.35)
  Top 0.152: v61.95,52.27 58.75,55.47 55.63,55.47 52.12,58.98 52.12,60.96 | v53.57,61.72 52.88,61.72 52.12,60.96 | 52.12,60.96 R22.2
  Bottom 0.152: R50.1 38.1,3.81 39.01,2.9 44.81,2.9 49.23,7.32 49.23,11.81 51.74,14.33 52.27,14.33 60.05,22.1 60.05,34.59 64.54,39.09 64.54,49.68 v61.95,52.27 | v53.57,61.72 59.36,67.51 59.36,79.32 62.18,82.14 62.18,82.53 OTA3.14
N$66
  Top 0.152: R45.1 55.85,39.4 50.14,39.4 46.02,43.51 40.31,43.51 37.72,46.1 31.32,46.1 30.48,46.94 C7.1
OUTA  (via drill 0.35)
  Top 0.152: v45.49,52.65 45.49,49.3 42.29,46.1 38.33,46.1 37.49,46.94 35.59,46.94 C7.2
  Bottom 0.152: v45.49,52.65 45.49,58.14 48.62,61.27 48.62,61.34 56.08,68.81 58.22,68.81 58.75,69.34 58.75,87.25 62.48,90.98 62.48,93.42 59.36,96.55 58.45,96.55 U$5.P$1
OUTAB
  Top 0.152: C12.2 50.75,49.53 54.63,53.42 58.37,53.42 U$9.P$1
OUTB
  Top 0.152: C11.2 57.23,3.81 58.37,2.67 U$6.P$1